# Altium schematic sheet FMC_connector_JK.SchDoc: FMC Connector JK
size A; Author: James Thomas; CompanyName: BYUI; DrawnBy: James Thomas; Engineer: James Thomas; Organization: CSEE; DocumentNumber: 14; Revision: 0.0.1; SheetNumber: 14; SheetTotal: 15
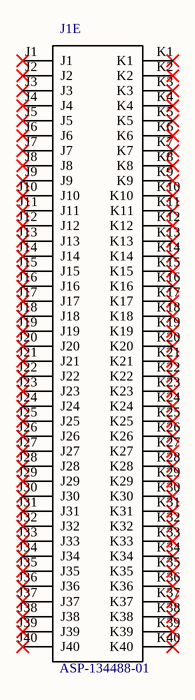
[diagram p0: FMC_connector_JK.SchDoc]

## Parts
J1  ASP-134488-01  [*SAMTEC_ASP-134488-01_ASP-134488-01(Primary)]  (part E of 5)

## Nets

Not connected (* = marked no-connect by the designer): J1 J1* J2* J3* J4* J5* J6* J7* J8* J9* J10* J11* J12* J13* J14* J15* J16* J17* J18* J19* J20* J21* J22* J23* J24* J25* J26* J27* J28* J29* J30* J31* J32* J33* J34* J35* J36* J37* J38* J39* J40* K1* K2* K3* K4* K5* K6* K7* K8* K9* K10* K11* K12* K13* K14* K15* K16* K17* K18* K19* K20* K21* K22* K23* K24* K25* K26* K27* K28* K29* K30* K31* K32* K33* K34* K35* K36* K37* K38* K39* K40*

## Library data of the parts
J1 = ASP-134488-01: SnapEDA_Link: https://www.snapeda.com/parts/ASP-134488-01/Samtec%20Inc./view-part/423215/?ref=snap; Value: *